# EAGLE design sensor_board (EAGLE 7.1.0)
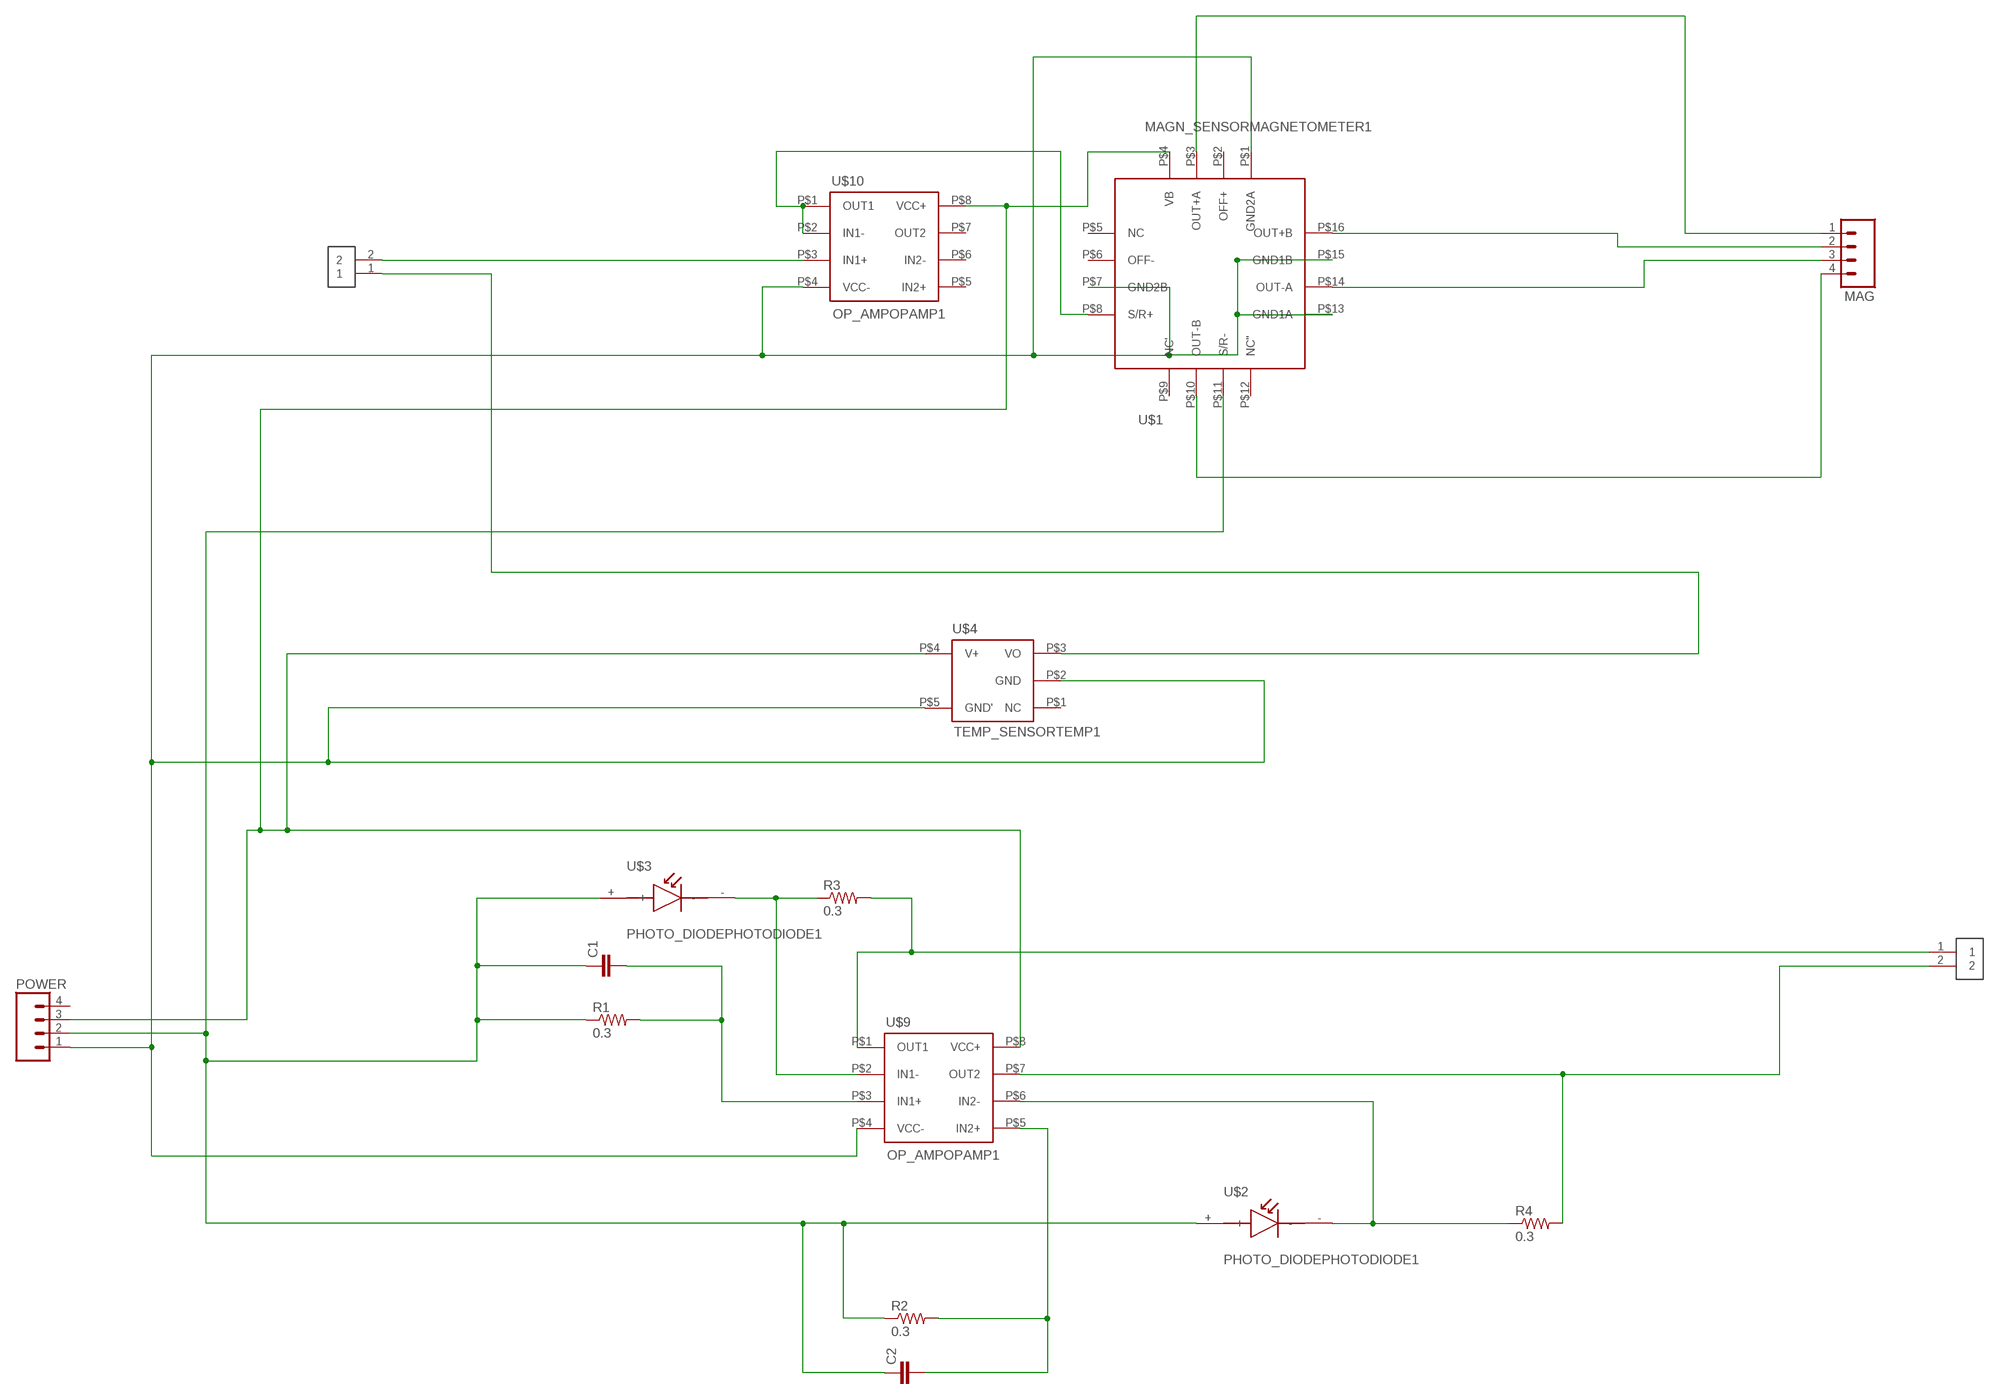
[diagram p0: schematic, sheet 1]

## Parts
C1  CAP0402-CAP  [0402-CAP]
C2  CAP0402-CAP  [0402-CAP]
MAG  1X04_HEADER"  [1X04_HEADER]
MAGSR_TEMP  1X02_HEADER  [1X02_HEADER]
PHOTODIODE_OUT  1X02_HEADER  [1X02_HEADER]
POWER  1X04_HEADER"  [1X04_HEADER]
R1  0.3  0.3OHM-1/8W-1%(0805)  [0805]
R2  0.3  0.3OHM-1/8W-1%(0805)  [0805]
R3  0.3  0.3OHM-1/8W-1%(0805)  [0805]
R4  0.3  0.3OHM-1/8W-1%(0805)  [0805]
U$1  MAGN_SENSORMAGNETOMETER1  [MAGNETOMETER]
U$2  PHOTO_DIODEPHOTODIODE1  [PHOTODIODE]
U$3  PHOTO_DIODEPHOTODIODE1  [PHOTODIODE]
U$4  TEMP_SENSORTEMP1  [TEMP]
U$9  OP_AMPOPAMP1  [OPAMP]
U$10  OP_AMPOPAMP1  [OPAMP]

## Nets
0V: POWER.1 U$1.P$1(GND2A) U$1.P$7(GND2B) U$1.P$13(GND1A) U$1.P$15(GND1B) U$4.P$2(GND) U$4.P$5(GND') U$9.P$4(VCC-) U$10.P$4(VCC-)
2.5V: C1.1 C2.1 POWER.2 R1.1 R2.1 U$1.P$11(S/R-) U$2.+ U$3.+
5V: POWER.3 U$1.P$4(VB) U$4.P$4(V+) U$9.P$8(VCC+) U$10.P$8(VCC+)
N$1: C1.2 R1.2 U$9.P$3(IN1+)
N$2: R3.1 U$3.- U$9.P$2(IN1-)
N$3: MAGSR_TEMP.2 U$10.P$3(IN1+)
N$4: U$1.P$8(S/R+) U$10.P$1(OUT1) U$10.P$2(IN1-)
N$5: C2.2 R2.2 U$9.P$5(IN2+)
N$6: R4.1 U$2.- U$9.P$6(IN2-)
N$7: PHOTODIODE_OUT.2 R4.2 U$9.P$7(OUT2)
N$10: PHOTODIODE_OUT.1 R3.2 U$9.P$1(OUT1)
N$11: MAG.1 U$1.P$3(OUT+A)
N$12: MAGSR_TEMP.1 U$4.P$3(VO)
N$13: MAG.4 U$1.P$10(OUT-B)
N$14: MAG.3 U$1.P$14(OUT-A)
N$15: MAG.2 U$1.P$16(OUT+B)
Unconnected: POWER.4 U$1.P$2(OFF+) U$1.P$5(NC) U$1.P$6(OFF-) U$1.P$9(NC') U$1.P$12(NC'') U$4.P$1(NC) U$10.P$5(IN2+) U$10.P$6(IN2-) U$10.P$7(OUT2)

## Library data of the parts
C1 C2 = SparkFun:CAP: Capacitor Standard 0603 ceramic capacitor, and 0.1" leaded capacitor.
MAG POWER = RBBB:1X04_HEADER: Header 4 Standard 4-pin 0.1" header. Use with straight break away headers (SKU : PRT-00116), right angle break away headers (PRT-00553), swiss pins (PRT-00743), machine pins (PRT-00117), and female headers (PRT-00115). Molex polarized connector foot print use with SKU : PRT-08231 with associated crimp pins and housings.
MAGSR_TEMP PHOTODIODE_OUT = RBBB:1X02_HEADER
R1-R4 = SparkFun-Resistors:0.3OHM-1/8W-1%(0805): RES-11622; PROD_ID: RES-11622
U$1 = watsat:MAGN_SENSOR
U$2 U$3 = watsat:PHOTO_DIODE
U$4 = watsat:TEMP_SENSOR
U$9 U$10 = watsat:OP_AMP

## Board
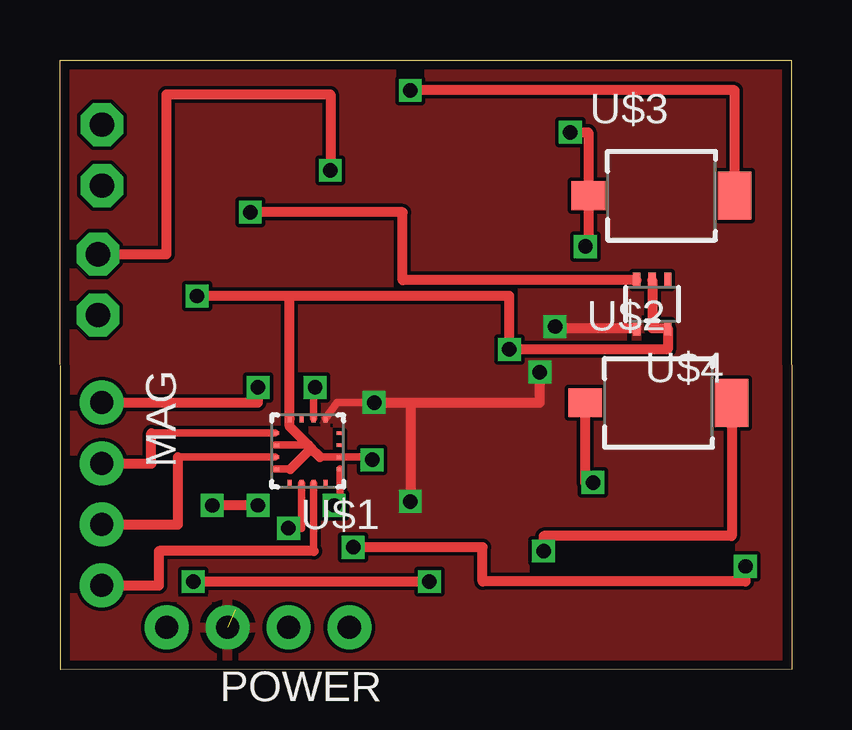
[diagram p1: board, top side]
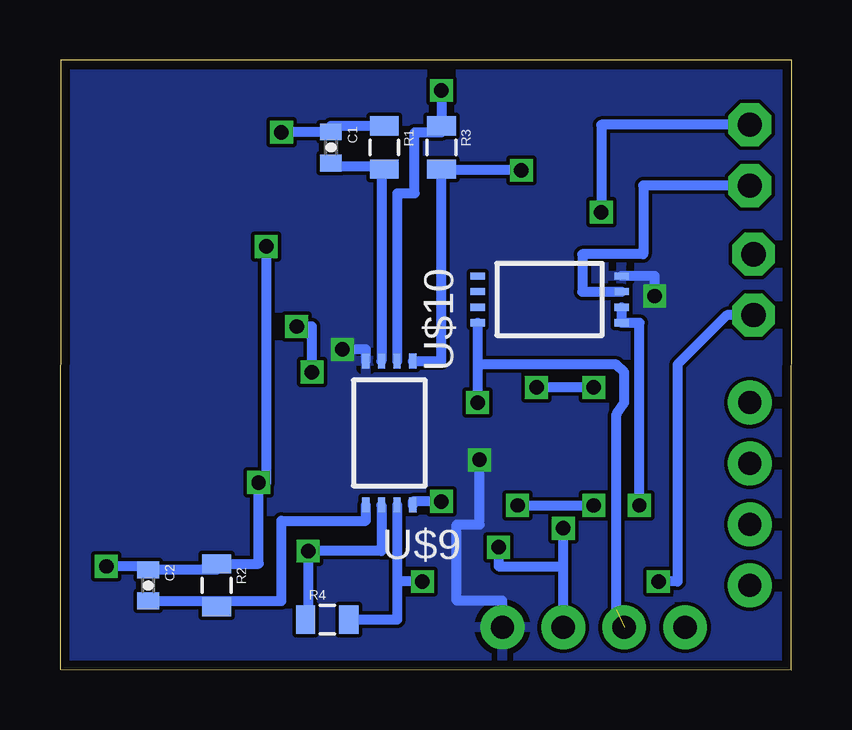
[diagram p2: board, bottom side, seen from below]

Size 30.51 x 25.42 mm. Coordinates in mm from the lower left corner, seen from the top.
Outline: 30.48,25.42 30.51,0.02 0.03,0 0,25.4 30.48,25.42
Copper layers (1*16): Top 0.0356mm / dielectric 1.5011mm / Bottom 0.0356mm
Design rules "LaenPCBOrder": minimum track width 6mil, minimum drill 13mil, track to track 6mil, track to pad 6mil, pad to pad 6mil, via to via 6mil, smd to smd 6mil, copper to edge 15mil, drill to drill 6mil, minimum pad ring 7mil, minimum via ring 7mil, stop-mask expansion 3mil, vias tented up to drill 0mil, thermal gap 10mil

### Footprints (pad centres in the part's own frame; a part is rotated, then mirrored left to right if it is on the bottom)
0402-CAP = smd 0.7 x 0.9: 1 -0.65,0; 2 0.65,0
1X04_HEADER = drill 0.965 pad 1.829: 1 0,0; 2 2.54,0; 3 5.08,0; 4 7.62,0
1X02_HEADER = drill 1.016 pad 1.778 octagon: 1 -1.27,0; 2 1.27,0
0805 = smd 0.8 x 1.2: 1 -0.9,0; 2 0.9,0
MAGNETOMETER = smd 0.152 x 0.305: P$1 0.75,-1.35; P$2 0.25,-1.35; P$3 -0.25,-1.35; P$4 -0.75,-1.35; P$9 -0.75,1.35; P$10 -0.25,1.35; P$11 0.25,1.35; P$12 0.75,1.35 | smd 0.305 x 0.152: P$5 -1.35,-0.75; P$6 -1.35,-0.25; P$7 -1.35,0.25; P$8 -1.35,0.75; P$13 1.35,0.75; P$14 1.35,0.25; P$15 1.35,-0.25; P$16 1.35,-0.75
PHOTODIODE = smd 1.4 x 1.2: + -3.05,0 | smd 1.4 x 2: - 3.05,0
TEMP = smd 0.305 x 0.61: P$1 -0.65,-1; P$2 0,-1; P$3 0.65,-1; P$4 0.65,1; P$5 -0.65,1
OPAMP = smd 0.305 x 0.61: P$1 -0.975,-3; P$2 -0.325,-3; P$3 0.325,-3; P$4 0.975,-3; P$5 0.975,3; P$6 0.325,3; P$7 -0.325,3; P$8 -0.975,3

### Placement (x,y rotation side)
C1  19.21,21.77 270 bottom
C2  26.83,3.51 270 bottom
MAG  1.75,11.13 270 top
MAGSR_TEMP  1.75,21.45 270 top
PHOTODIODE_OUT  1.59,16.05 270 top
POWER  12.06,1.76 180 top
R1  16.99,21.77 270 bottom
R2  23.97,3.51 270 bottom
R3  14.61,21.77 270 bottom
R4  19.37,2.08 0 bottom
U$1  10.32,9.11 180 top
U$2  24.95,11.12 0 top
U$3  25.08,19.76 0 top
U$4  24.69,15.24 180 top
U$9  16.78,9.87 180 bottom
U$10  10.1,15.43 90 bottom

### Tracks (layer width: path | path; a pad name or v marks a point on that pad's centre or on a via)
0V  (via drill 0.6)
  Top 0.305: 10.84,8.86 U$1.P$7 13.02,8.86 | U$1.P$15 10.29,9.36 | U$1.P$13 9.61,8.36
  Top 0.406: U$4.P$2 24.69,14.24 U$4.P$5 25.34,13.35 v18.73,13.35 18.73,15.57 9.57,15.57 | 9.57,15.57 v5.71,15.57 | 9.57,15.57 U$1.P$1 9.57,10.13 10.32,9.38 | 10.84,8.86 10.48,9.22 | 10.48,9.22 10.32,9.38 | 10.29,9.36 arc90 10.32,9.38 | 9.61,8.36 10.48,9.22 | v13.02,8.75 13.02,8.86
  Bottom 0.406: v5.71,15.57 5.71,16.41 U$10.P$4 | U$9.P$4 17.75,13.35 v18.73,13.35 | POWER.1 12.06,2.87 13.97,2.87 13.97,6.05 13.02,6.05 v13.02,8.75
  pour Bottom: -2.38,26.53 31.75,26.53 31.75,-2.05 -2.38,-2.05
2.5V  (via drill 0.6)
  Top 0.305: v9.53,5.89 10.07,5.89 U$1.P$11
  Top 0.406: v22.23,7.8 21.9,7.8 U$2.+ | v21.27,22.4 22.03,22.4 U$3.+ 22.03,17.64 v21.91,17.64 | v28.57,4.3 28.57,3.67 17.62,3.67 17.62,5.1 v12.22,5.1
  Bottom 0.406: POWER.2 9.53,4.3 | 9.53,4.3 v9.53,5.89 | R1.1 19.21,22.67 C1.1 21.27,22.42 v21.27,22.4 | v21.91,17.64 21.91,7.8 v22.23,7.8 22.23,4.41 R2.1 23.97,4.16 C2.1 26.83,4.3 v28.57,4.3 | v12.22,5.1 12.22,4.3 9.53,4.3
5V  (via drill 0.6)  (1 unrouted)
  Top 0.305: U$1.P$4 11.55,11.13 v13.1,11.13
  Top 0.406: 14.61,11.13 v14.61,7 | 14.61,11.13 20,11.13 v20,12.4 | v20.64,14.3 20.64,14.24 U$4.P$4 | v13.1,11.13 14.61,11.13
  Bottom 0.406: U$10.P$8 13.1,12.72 | 13.1,12.72 v13.1,11.13 | v14.61,7 15.8,7 U$9.P$8 | v20,12.4 20,14.3 v20.64,14.3 | 7.3,2.49 7.3,10.65 6.99,11.13 6.99,12.4 7.3,12.72 13.1,12.72
  pour Top: -1.59,26.37 31.59,26.37 31.59,-1.41 -1.59,-1.41
N$1
  Bottom 0.406: C1.2 19.21,20.97 16.99,20.97 R1.2 17.1,20.87 U$9.P$3
N$2  (via drill 0.6)
  Top 0.406: U$3.- 28.13,24.15 v14.61,24.15
  Bottom 0.406: U$9.P$2 16.45,19.86 15.72,19.86 15.72,22.4 14.61,22.4 R3.1 v14.61,24.15
N$3
  Bottom 0.406: MAGSR_TEMP.2 6.19,20.18 6.19,17.32 8.73,17.32 8.73,15.76 U$10.P$3
N$4  (via drill 0.6)
  Top 0.305: U$1.P$8 11.68,6.84 v11.43,6.84
  Top 0.406: v8.26,6.84 v6.35,6.84
  Bottom 0.406: U$10.P$2 U$10.P$1 6.35,14.46 v6.35,6.84 | v11.43,6.84 v8.26,6.84
N$5
  Bottom 0.406: C2.2 23.97,2.86 | 23.97,2.86 R2.2 | 23.97,2.86 21.27,2.86 21.27,6.21 17.75,6.21 U$9.P$5
N$6  (via drill 0.6)
  Top 0.406: U$2.- 28,5.57 20.16,5.57 v20.16,4.94
  Bottom 0.406: R4.1 20.16,2.08 v20.16,4.94 17.1,4.94 U$9.P$6
N$7  (via drill 0.6)
  Top 0.406: v5.56,3.67 v15.4,3.67
  Bottom 0.406: U$9.P$7 16.45,3.67 | 16.45,3.67 16.45,2.08 R4.2 | PHOTODIODE_OUT.2 2.7,14.78 4.76,12.72 4.76,3.67 v5.56,3.67 | v15.4,3.67 16.45,3.67
N$10  (via drill 0.6)
  Top 0.406: PHOTODIODE_OUT.1 4.45,17.32 4.45,23.99 11.27,23.99 v11.27,20.81
  Bottom 0.406: U$9.P$1 14.61,12.87 R3.2 14.61,20.81 v11.27,20.81
N$11  (via drill 0.6)
  Top 0.305: 10.57,11.77 U$1.P$3
  Top 0.406: v10.64,11.77 10.57,11.77 | MAG.1 8.26,11.13 v8.26,11.77
  Bottom 0.406: v8.26,11.77 v10.64,11.77
N$12  (via drill 0.6)
  Top 0.406: U$4.P$3 14.29,16.24 14.29,19.07 v7.94,19.07
  Bottom 0.406: MAGSR_TEMP.1 7.94,22.72 v7.94,19.07
N$13
  Top 0.305: U$1.P$10 10.57,4.94
  Top 0.406: 10.57,4.94 4.13,4.94 4.13,3.51 MAG.4
N$14
  Top 0.305: 4.92,8.86 U$1.P$14
  Top 0.406: MAG.3 4.92,6.05 4.92,8.86
N$15
  Top 0.305: 3.81,9.86 U$1.P$16
  Top 0.406: MAG.2 3.81,8.59 3.81,9.86